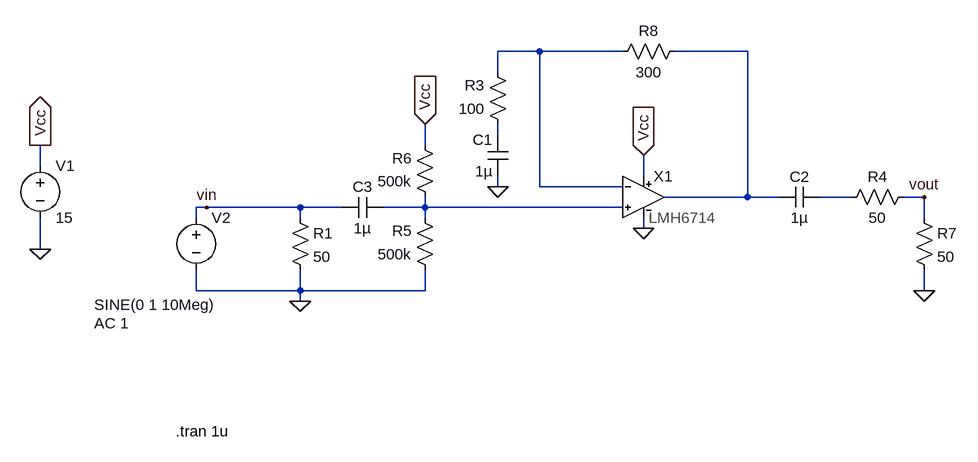
[diagram p0: schematic LMH6714_test.asc]
LMH6714_test.asc, the LTspice schematic file:
Version 4
SHEET 1 976 680
WIRE 96 -112 32 -112
WIRE 224 -112 96 -112
WIRE 416 -112 304 -112
WIRE 32 -80 32 -112
WIRE 32 16 32 0
WIRE -80 32 -80 0
WIRE -672 64 -672 32
WIRE 256 80 256 48
WIRE 32 96 32 80
WIRE 96 96 96 -112
WIRE 224 96 96 96
WIRE 416 112 416 -112
WIRE 416 112 288 112
WIRE 464 112 416 112
WIRE 576 112 528 112
WIRE 688 112 656 112
WIRE -416 128 -432 128
WIRE -272 128 -416 128
WIRE -208 128 -272 128
WIRE -80 128 -80 112
WIRE -80 128 -144 128
WIRE 224 128 -80 128
WIRE -432 144 -432 128
WIRE -272 144 -272 128
WIRE -80 144 -80 128
WIRE 688 144 688 112
WIRE 256 160 256 144
WIRE -672 192 -672 144
WIRE -432 256 -432 224
WIRE -272 256 -272 224
WIRE -272 256 -432 256
WIRE -80 256 -80 224
WIRE -80 256 -272 256
WIRE 688 256 688 224
WIRE -272 272 -272 256
FLAG -272 272 0
FLAG 256 160 0
FLAG 688 256 0
FLAG 32 96 0
FLAG 688 112 vout
FLAG -416 128 vin
FLAG -672 192 0
FLAG -672 32 Vcc
IOPIN -672 32 Out
FLAG 256 48 Vcc
IOPIN 256 48 In
FLAG -80 0 Vcc
IOPIN -80 0 In
SYMBOL res -288 128 R0
SYMATTR InstName R1
SYMATTR Value 50
SYMBOL cap 48 80 R180
WINDOW 0 24 56 Left 2
WINDOW 3 24 8 Left 2
SYMATTR InstName C1
SYMATTR Value 1µ
SYMBOL res 48 16 R180
WINDOW 0 36 76 Left 2
WINDOW 3 36 40 Left 2
SYMATTR InstName R3
SYMATTR Value 100
SYMBOL cap 528 96 R90
WINDOW 0 0 32 VBottom 2
WINDOW 3 32 32 VTop 2
SYMATTR InstName C2
SYMATTR Value 1µ
SYMBOL res 672 96 R90
WINDOW 0 0 56 VBottom 2
WINDOW 3 32 56 VTop 2
SYMATTR InstName R4
SYMATTR Value 50
SYMBOL res -64 240 R180
WINDOW 0 36 76 Left 2
WINDOW 3 36 40 Left 2
SYMATTR InstName R5
SYMATTR Value 500k
SYMBOL res -64 128 R180
WINDOW 0 36 76 Left 2
WINDOW 3 36 40 Left 2
SYMATTR InstName R6
SYMATTR Value 500k
SYMBOL res 672 128 R0
SYMATTR InstName R7
SYMATTR Value 50
SYMBOL res 320 -128 R90
WINDOW 0 0 56 VBottom 2
WINDOW 3 32 56 VTop 2
SYMATTR InstName R8
SYMATTR Value 300
SYMBOL cap -144 112 R90
WINDOW 0 0 32 VBottom 2
WINDOW 3 32 32 VTop 2
SYMATTR InstName C3
SYMATTR Value 1µ
SYMBOL voltage -672 48 R0
WINDOW 123 0 0 Left 0
WINDOW 39 0 0 Left 0
SYMATTR InstName V1
SYMATTR Value 15
SYMBOL voltage -432 128 R0
WINDOW 3 -157 150 Left 2
WINDOW 123 -157 178 Left 2
WINDOW 39 0 0 Left 0
SYMATTR Value SINE(0 1 10Meg)
SYMATTR Value2 AC 1
SYMATTR InstName V2
SYMBOL AutoGenerated\\LMH6714 256 112 R0
SYMATTR InstName X1
TEXT -464 472 Left 2 !.tran 1u

The netlist it stands for:
* LMH6714_test.asc
R1 vin 0 50
C1 0 N003 1µ
R3 N003 N001 100
C2 N004 N002 1µ
R4 vout N004 50
R5 0 N005 500k
R6 N005 Vcc 500k
R7 vout 0 50
R8 N002 N001 300
C3 N005 vin 1µ
V1 Vcc 0 15
V2 vin 0 SINE(0 1 10Meg) AC 1
XX1 N005 N001 Vcc 0 N002 LMH6714  ; pins In+ In- V+ V- OUT
.tran 1u
.lib D:\Usuario\Desktop\Active Antenna\LMH6714\LMH6714.MOD
.backanno
.end